# EAGLE schematic RX-Super-Regenerative-Aurel-ASR2 (EAGLE 7.2.0)
https://sites.google.com/site/aurelwwiz/aurelso
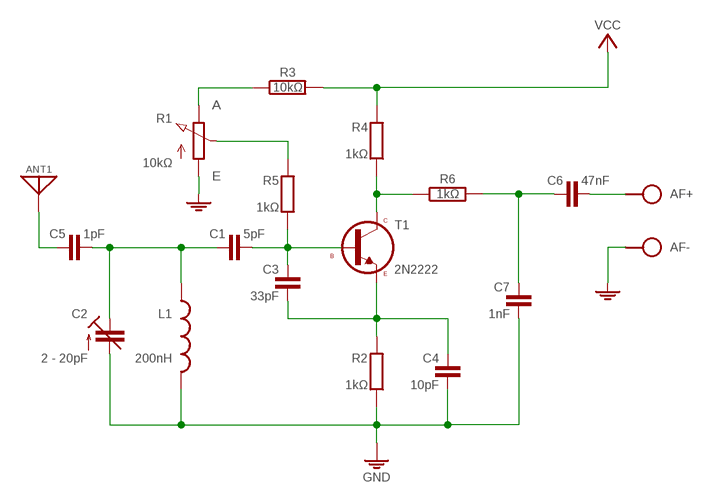
[diagram p0: schematic, sheet 1]

## Parts
AF  SPAD+-+-  [SPAD+-]
ANT1  ANT  [SPAD]
C1  5pF  C-H025-015X024  [C025-015X024]
C2  2 - 20pF  C-TR-PH201272222-808-2PINB  [TRIM-2222-808]
C3  33pF  C025-015X024  [C025-015X024]
C4  10pF  C025-015X024  [C025-015X024]
C5  1pF  C-H025-015X024  [C025-015X024]
C6  47nF  C-H050-020X044  [C050-020X044]
C7  1nF  C050-020X044/V  [C050-020X044/V]
L1  200nH  L04/7-V  [L-04/7-V]
R1  10kΩ  POT  [POT]
R2  1kΩ  R0204/10-V  [0204/10-V]
R3  10kΩ  R-H0204/10  [0204/10]
R4  1kΩ  R0204/10-V  [0204/10-V]
R5  1kΩ  R0204/10-V  [0204/10-V]
R6  1kΩ  R-H0204/10  [0204/10]
S2  VCC_GNDPWR-L  [PWR-L]
T1  2N2222  [TO92-EBC]

## Nets
GND: AF.1 C2.2(A) C4.2 C7.2 L1.2 R1.A R2.2 S2.1
N$1: ANT1.1 C5.1
N$2: C1.1 C2.3(E) C5.2 L1.1
N$3: C1.2 C3.1 R5.2 T1.B
N$5: C3.2 C4.1 R2.1 T1.E
N$6: R4.2 R6.1 T1.C
N$7: R1.S R5.1
N$8: R1.E R3.1
N$10: C6.1 C7.1 R6.2
N$11: AF.2 C6.2
VCC: R3.2 R4.1 S2.2

## Library data of the parts
AF = pad:SPAD+-
ANT1 = pad:ANT
C1 C5 C6 = c:C-H
C2 = cap-trim:C-TR-PH20127
C3 C4 C7 = c:C: CAPACITOR, European symbol
L1 = l:L: Potentiometers Beckman, Copal, Piher, Spectrol, Schukat Created by librarian@cadsoft.de
R1 = r:POT
R2 R4 R5 = r:R: RESISTOR, European symbol
R3 R6 = r:R-H
S2 = pad:VCC_GND
T1 = t:2N2222